# EAGLE design octosonarX2 (EAGLE 8.2.2)
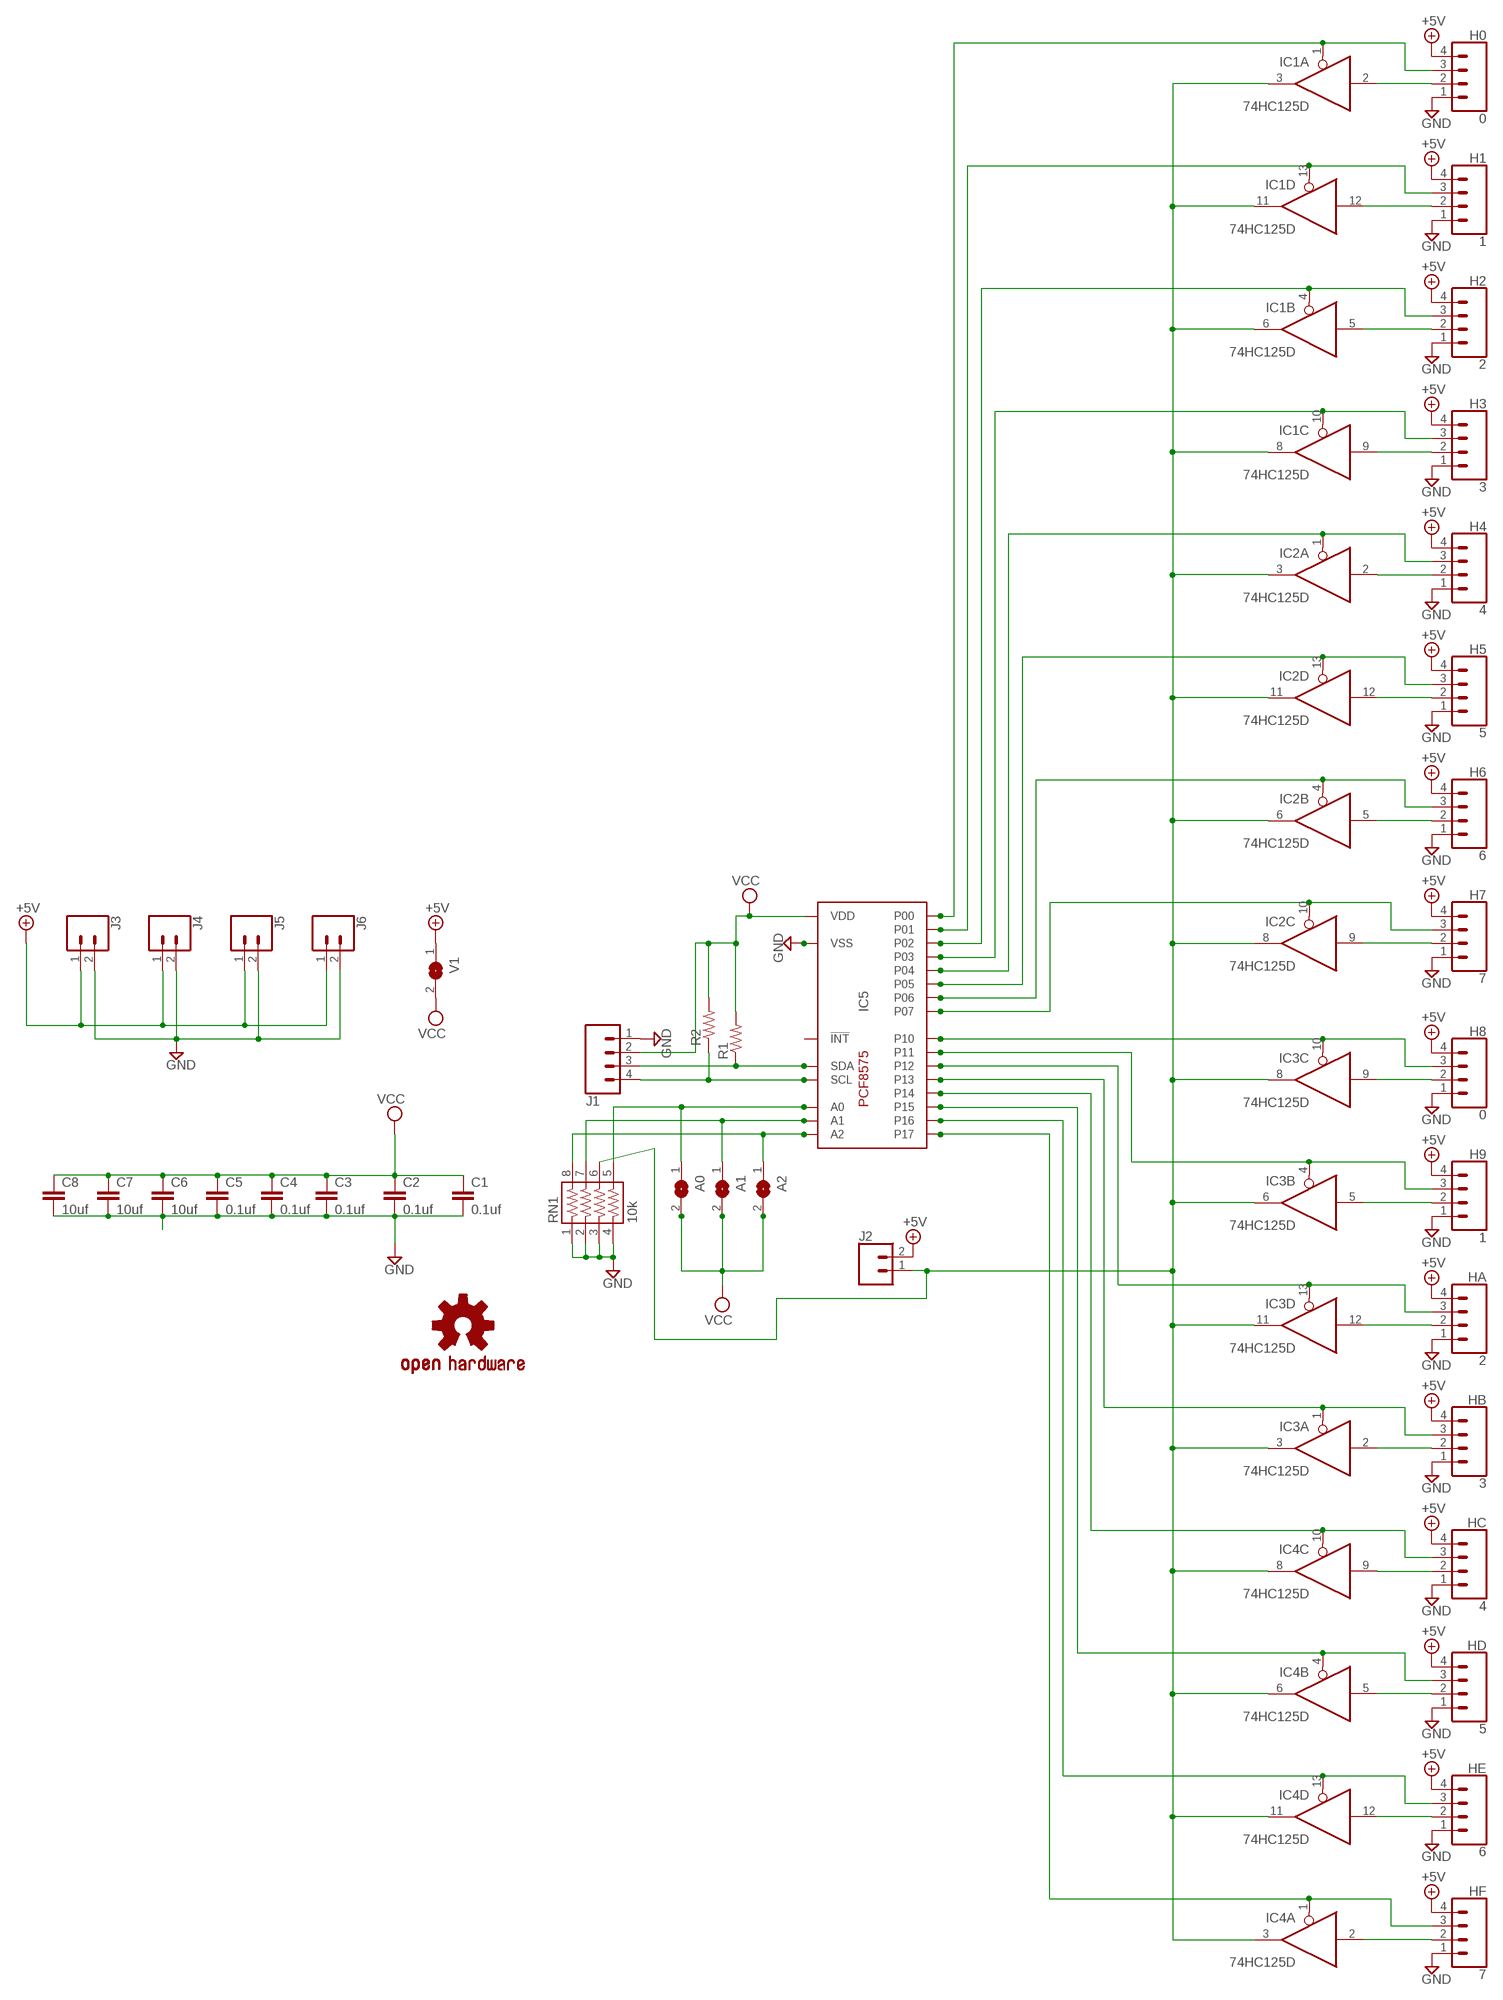
[diagram p0: schematic, sheet 1]

## Parts
A0  SJ  [SJ]
A1  SJ  [SJ]
A2  SJ  [SJ]
C1  0.1uf  C-EUC0603  [C0603]
C2  0.1uf  C-EUC0603  [C0603]
C3  0.1uf  C-EUC0603  [C0603]
C4  0.1uf  C-EUC0603  [C0603]
C5  0.1uf  C-EUC0603  [C0603]
C6  10uf  C-EUC0603  [C0603]
C7  10uf  C-EUC0805  [C0805]
C8  10uf  C-EUC0805  [C0805]
H0  0  CONN_04  [1X04]
H1  1  CONN_04  [1X04]
H2  2  CONN_04  [1X04]
H3  3  CONN_04  [1X04]
H4  4  CONN_04  [1X04]
H5  5  CONN_04  [1X04]
H6  6  CONN_04  [1X04]
H7  7  CONN_04  [1X04]
H8  0  CONN_04  [1X04]
H9  1  CONN_04  [1X04]
HA  2  CONN_04  [1X04]
HB  3  CONN_04  [1X04]
HC  4  CONN_04  [1X04]
HD  5  CONN_04  [1X04]
HE  6  CONN_04  [1X04]
HF  7  CONN_04  [1X04]
IC1  74HC125D  [SO14]
IC2  74HC125D  [SO14]
IC3  74HC125D  [SO14]
IC4  74HC125D  [SO14]
IC5  PCF8575C  [SOP24]
J1  CONN_04POLAR_LOCK  [MOLEX-1X4_LOCK]
J2  CONN_02POLAR_LOCK  [MOLEX-1X2_LOCK]
J3  CONN_02  [1X02]
J4  CONN_02  [1X02]
J5  CONN_02  [1X02]
J6  CONN_02  [1X02]
LOGO1  OSHW-LOGOL  [OSHW-LOGO-L]
R1  R-US_0204/2V  [0204V]
R2  R-US_0204/2V  [0204V]
RN1  10k  743-8  [743-8]
V1  SJ  [SJ]

## Nets
+5V: H0.4 H1.4 H2.4 H3.4 H4.4 H5.4 H6.4 H7.4 H8.4 H9.4 HA.4 HB.4 HC.4 HD.4 HE.4 HF.4 J2.2 J3.1 J4.1 J5.1 J6.1 V1.1
GND: C1.2 C2.2 C3.2 C4.2 C5.2 C6.2 C7.2 C8.2 H0.1 H1.1 H2.1 H3.1 H4.1 H5.1 H6.1 H7.1 H8.1 H9.1 HA.1 HB.1 HC.1 HD.1 HE.1 HF.1 IC5.P$12(VSS) J1.1 J3.2 J4.2 J5.2 J6.2 RN1.1 RN1.2 RN1.3 RN1.4
INT: IC1.3(A:O) IC1.6(B:O) IC1.8(C:O) IC1.11(D:O) IC2.3(A:O) IC2.6(B:O) IC2.8(C:O) IC2.11(D:O) IC3.3(A:O) IC3.6(B:O) IC3.8(C:O) IC3.11(D:O) IC4.3(A:O) IC4.6(B:O) IC4.8(C:O) IC4.11(D:O) J2.1 RN1.6
N$1: H8.3 IC3.10(C:OE) IC5.P$13(P10)
N$2: H9.3 IC3.4(B:OE) IC5.P$14(P11)
N$3: HA.3 IC3.13(D:OE) IC5.P$15(P12)
N$4: HB.3 IC3.1(A:OE) IC5.P$16(P13)
N$5: HC.3 IC4.10(C:OE) IC5.P$17(P14)
N$6: HD.3 IC4.4(B:OE) IC5.P$18(P15)
N$7: HE.3 IC4.13(D:OE) IC5.P$19(P16)
N$8: HF.3 IC4.1(A:OE) IC5.P$20(P17)
N$9: H8.2 IC3.9(C:I)
N$10: H9.2 IC3.5(B:I)
N$11: HA.2 IC3.12(D:I)
N$12: HB.2 IC3.2(A:I)
N$13: HD.2 IC4.5(B:I)
N$14: HE.2 IC4.12(D:I)
N$15: HF.2 IC4.2(A:I)
N$16: HC.2 IC4.9(C:I)
N$18: A2.1 IC5.P$3(A2) RN1.8
N$19: A1.1 IC5.P$2(A1) RN1.7
N$20: A0.1 IC5.P$21(A0) RN1.5
N$25: H0.3 IC1.1(A:OE) IC5.P$4(P00)
N$26: H1.3 IC1.13(D:OE) IC5.P$5(P01)
N$27: H2.3 IC1.4(B:OE) IC5.P$6(P02)
N$28: H3.3 IC1.10(C:OE) IC5.P$7(P03)
N$29: H4.3 IC2.1(A:OE) IC5.P$8(P04)
N$30: H5.3 IC2.13(D:OE) IC5.P$9(P05)
N$31: H6.3 IC2.4(B:OE) IC5.P$10(P06)
N$32: H7.3 IC2.10(C:OE) IC5.P$11(P07)
N$33: H0.2 IC1.2(A:I)
N$34: H1.2 IC1.12(D:I)
N$35: H2.2 IC1.5(B:I)
N$36: H3.2 IC1.9(C:I)
N$37: H5.2 IC2.12(D:I)
N$38: H6.2 IC2.5(B:I)
N$39: H7.2 IC2.9(C:I)
N$40: H4.2 IC2.2(A:I)
SCL: IC5.P$22(SCL) J1.4 R2.1
SDA: IC5.P$23(SDA) J1.3 R1.1
VCC: A0.2 A1.2 A2.2 C1.1 C2.1 C3.1 C4.1 C5.1 C6.1 C7.1 C8.1 IC5.P$24(VDD) J1.2 R1.2 R2.2 V1.2
Unconnected: IC5.P$1(!INT)

## Power pins joined to a net without a drawn wire
GND: IC1.7(P:GND) IC2.7(P:GND) IC3.7(P:GND) IC4.7(P:GND)
VCC: IC1.14(P:VCC) IC2.14(P:VCC) IC3.14(P:VCC) IC4.14(P:VCC)

## Library data of the parts
A0 A1 A2 V1 = jumper:SJ: SMD solder JUMPER
C1-C8 = resistor:C-EU: CAPACITOR, European symbol
H0 H1-H9 HA HB HC HD HE HF = SparkFun-Connectors:CONN_04: Multi connection point. Often used as Generic Header-pin footprint for 0.1 inch spaced/style header connections On any of the 0.1 inch spaced packages, you can populate with these: Break Away Headers - Straight <https://www.sparkfun.com/products/116> (PRT-00116) Break Away Male Headers - Right Angle <https://www.sparkfun.com/products/553> (PRT-00553) Female Headers <https://www.sparkfun.com/products/115> (PRT-00115) Break Away Headers - Machine Pin <https://www.sparkfun.com/products/117> (PRT-00117) Break Away Female Headers - Swiss Machine Pin <https://www.sparkfun.com/products/743> (PRT-00743) For SCREWTERMINALS and SPRING TERMINALS visit here: Screw Terimnals on SparkFun.com <https://www.sparkfun.com/search/results?term=Screw+Terminals> (5mm/3.5mm/2.54mm spacing) This device is also useful as a general connection point to wire up your design to another part of your project. Our various solder wires solder well into these plated through hole pads. Hook-Up Wire - Assortment (Stranded, 22 AWG) <https://www.sparkfun.com/products/11375> (PRT-11375) Hook-Up Wire - Assortment (Solid Core, 22 AWG) <https://www.sparkfun.com/products/11367> (PRT-11367) View the entire wire category on our website here <https://www.sparkfun.com/categories/141> Special notes: Molex polarized connector foot print use with SKU : PRT-08231 with associated crimp pins and housings. 1MM SMD Version SKU: PRT-10208; PROD_ID: CONN-09696
IC1-IC4 = 74xx-eu:74*125: Quad bus BUFFER, 3-state
IC5 = pcf8575c:PCF8575C
J1 = SparkFun-Connectors:CONN_04: Multi connection point. Often used as Generic Header-pin footprint for 0.1 inch spaced/style header connections On any of the 0.1 inch spaced packages, you can populate with these: Break Away Headers - Straight <https://www.sparkfun.com/products/116> (PRT-00116) Break Away Male Headers - Right Angle <https://www.sparkfun.com/products/553> (PRT-00553) Female Headers <https://www.sparkfun.com/products/115> (PRT-00115) Break Away Headers - Machine Pin <https://www.sparkfun.com/products/117> (PRT-00117) Break Away Female Headers - Swiss Machine Pin <https://www.sparkfun.com/products/743> (PRT-00743) For SCREWTERMINALS and SPRING TERMINALS visit here: Screw Terimnals on SparkFun.com <https://www.sparkfun.com/search/results?term=Screw+Terminals> (5mm/3.5mm/2.54mm spacing) This device is also useful as a general connection point to wire up your design to another part of your project. Our various solder wires solder well into these plated through hole pads. Hook-Up Wire - Assortment (Stranded, 22 AWG) <https://www.sparkfun.com/products/11375> (PRT-11375) Hook-Up Wire - Assortment (Solid Core, 22 AWG) <https://www.sparkfun.com/products/11367> (PRT-11367) View the entire wire category on our website here <https://www.sparkfun.com/categories/141> Special notes: Molex polarized connector foot print use with SKU : PRT-08231 with associated crimp pins and housings. 1MM SMD Version SKU: PRT-10208; PROD_ID: CONN-08186; SF_ID: PRT-08231
J2 = SparkFun-Connectors:CONN_02: Multi connection point. Often used as Generic Header-pin footprint for 0.1 inch spaced/style header connections On any of the 0.1 inch spaced packages, you can populate with these: Break Away Headers - Straight <https://www.sparkfun.com/products/116> (PRT-00116) Break Away Male Headers - Right Angle <https://www.sparkfun.com/products/553> (PRT-00553) Female Headers <https://www.sparkfun.com/products/115> (PRT-00115) Break Away Headers - Machine Pin <https://www.sparkfun.com/products/117> (PRT-00117) Break Away Female Headers - Swiss Machine Pin <https://www.sparkfun.com/products/743> (PRT-00743) For SCREWTERMINALS and SPRING TERMINALS visit here: Screw Terimnals on SparkFun.com <https://www.sparkfun.com/search/results?term=Screw+Terminals> (5mm/3.5mm/2.54mm spacing) This device is also useful as a general connection point to wire up your design to another part of your project. Our various solder wires solder well into these plated through hole pads. Hook-Up Wire - Assortment (Stranded, 22 AWG) <https://www.sparkfun.com/products/11375> (PRT-11375) Hook-Up Wire - Assortment (Solid Core, 22 AWG) <https://www.sparkfun.com/products/11367> (PRT-11367) View the entire wire category on our website here <https://www.sparkfun.com/categories/141> Special notes: Molex polarized connector foot print use with: PRT-08233 with associated crimp pins and housings. 2.54_SCREWTERM for use with PRT-10571. 3.5mm Screw Terminal footprints for PRT-08084 5mm Screw Terminal footprints for use with PRT-08432; SF_ID: PRT-09918
J3-J6 = SparkFun-Connectors:CONN_02: Multi connection point. Often used as Generic Header-pin footprint for 0.1 inch spaced/style header connections On any of the 0.1 inch spaced packages, you can populate with these: Break Away Headers - Straight <https://www.sparkfun.com/products/116> (PRT-00116) Break Away Male Headers - Right Angle <https://www.sparkfun.com/products/553> (PRT-00553) Female Headers <https://www.sparkfun.com/products/115> (PRT-00115) Break Away Headers - Machine Pin <https://www.sparkfun.com/products/117> (PRT-00117) Break Away Female Headers - Swiss Machine Pin <https://www.sparkfun.com/products/743> (PRT-00743) For SCREWTERMINALS and SPRING TERMINALS visit here: Screw Terimnals on SparkFun.com <https://www.sparkfun.com/search/results?term=Screw+Terminals> (5mm/3.5mm/2.54mm spacing) This device is also useful as a general connection point to wire up your design to another part of your project. Our various solder wires solder well into these plated through hole pads. Hook-Up Wire - Assortment (Stranded, 22 AWG) <https://www.sparkfun.com/products/11375> (PRT-11375) Hook-Up Wire - Assortment (Solid Core, 22 AWG) <https://www.sparkfun.com/products/11367> (PRT-11367) View the entire wire category on our website here <https://www.sparkfun.com/categories/141> Special notes: Molex polarized connector foot print use with: PRT-08233 with associated crimp pins and housings. 2.54_SCREWTERM for use with PRT-10571. 3.5mm Screw Terminal footprints for PRT-08084 5mm Screw Terminal footprints for use with PRT-08432
LOGO1 = SparkFun-Aesthetics:OSHW-LOGO: Open-Source Hardware (OSHW) Logo This logo indicates the piece of hardware it is found on incorporates a OSHW license and/or adheres to the definition of open source hardware found here: http://freedomdefined.org/OSHW
R1 R2 = rcl:R-US_: RESISTOR, American symbol
RN1 = resistor-array:743-8: CTS 743 Series 8 Terminations, 4 Resistors

## Board
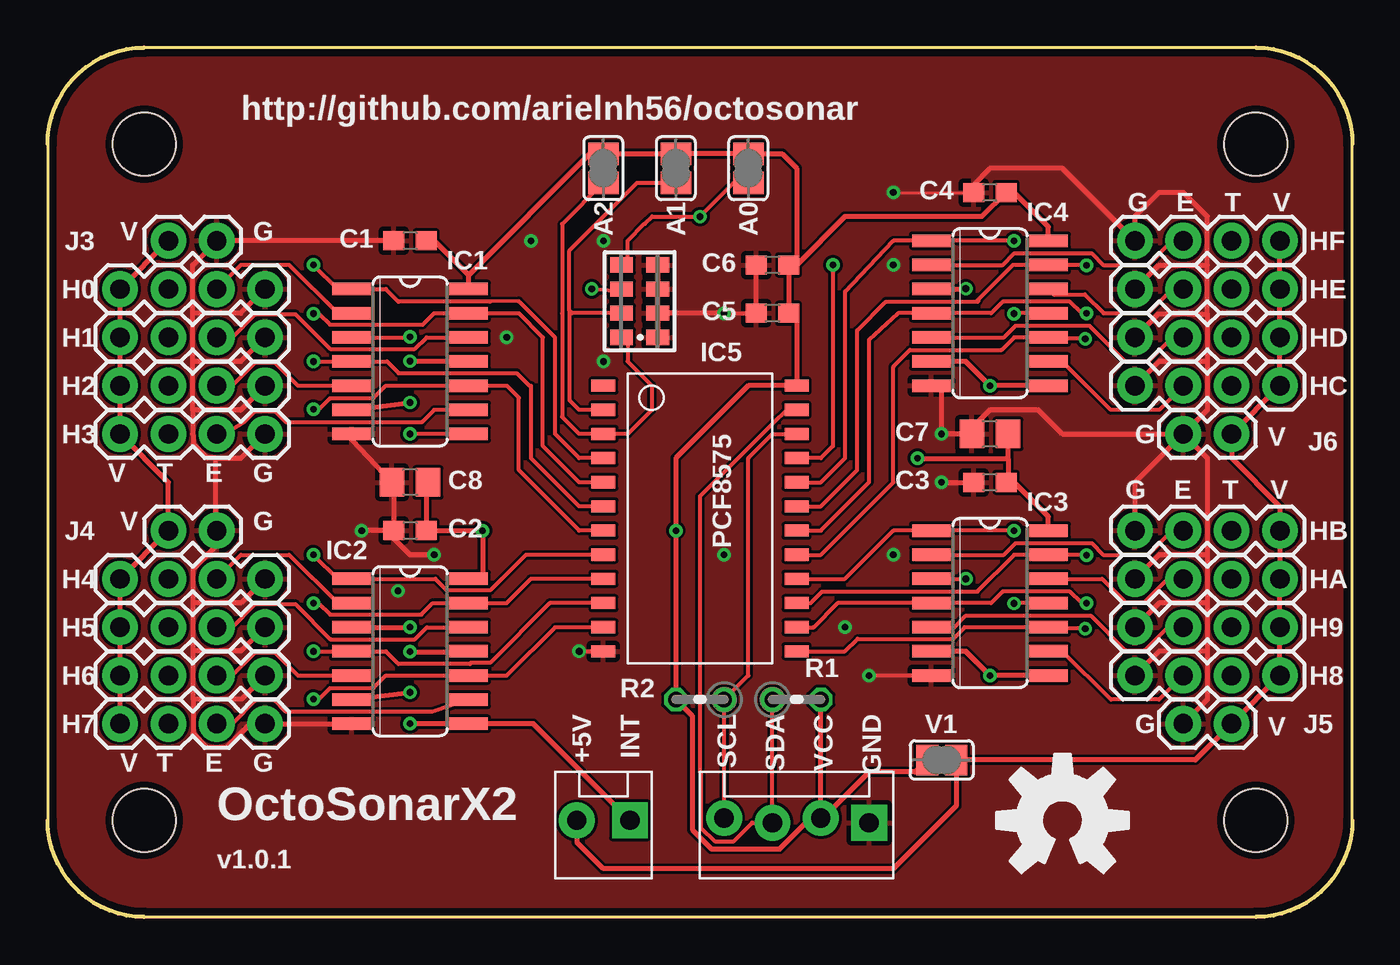
[diagram p1: board, top side]
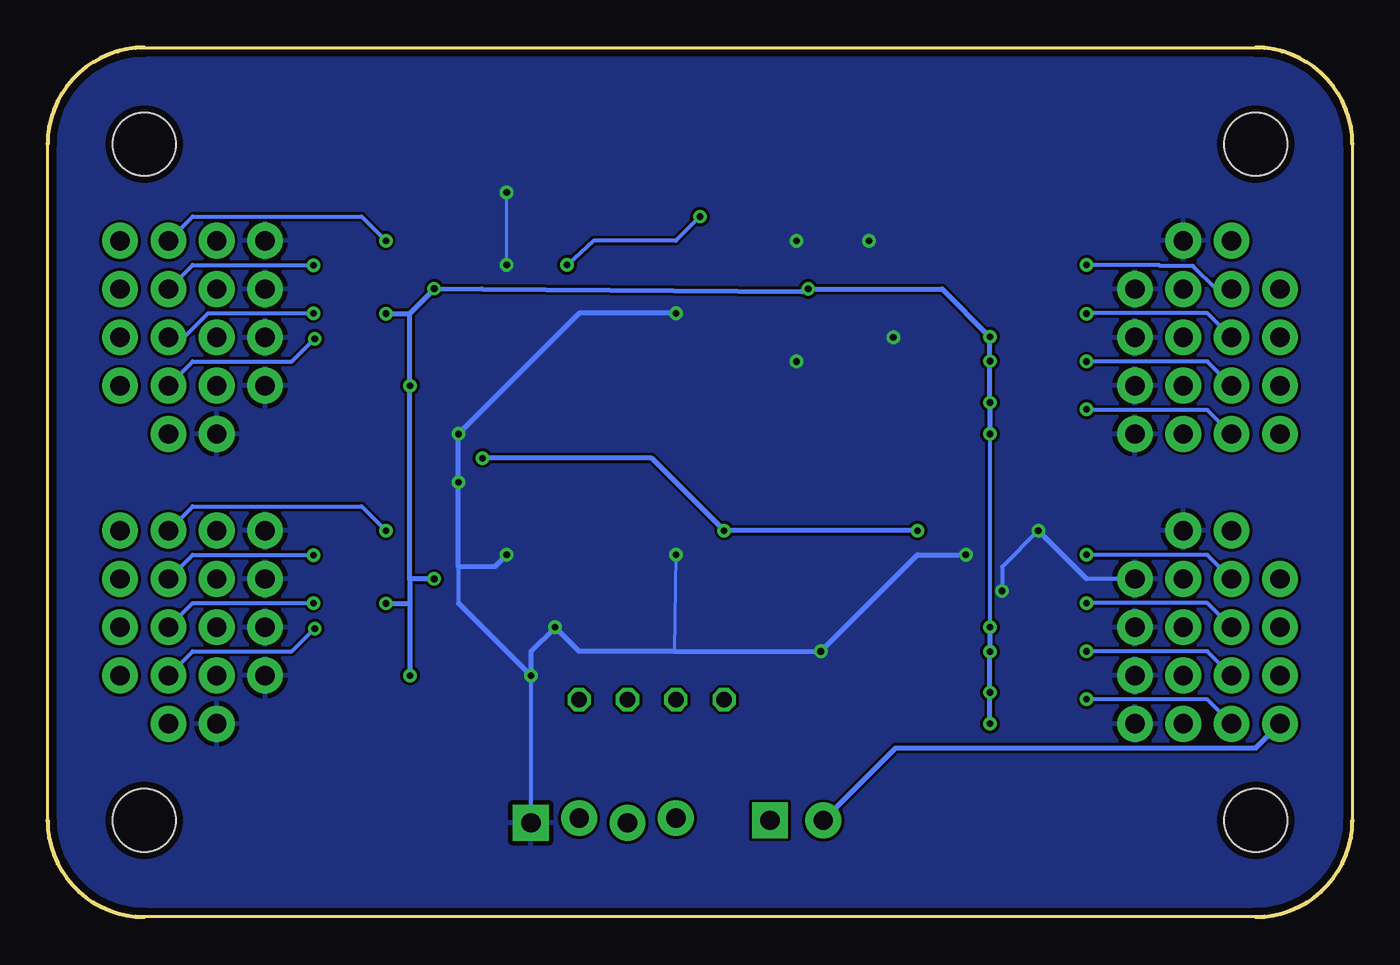
[diagram p2: board, bottom side, seen from below]

Size 68.58 x 45.72 mm. Coordinates in mm from the lower left corner, seen from the top.
Outline: 5.08,0 63.5,0 arc90 68.58,5.08 68.58,40.64 arc90 63.5,45.72 5.08,45.72 arc90 0,40.64 0,5.08 arc90 5.08,0
Copper layers (1*16): Top 0.0356mm / dielectric 1.5011mm / Bottom 0.0356mm
Design rules "mypcbway": minimum track width 6mil, minimum drill 13mil, track to track 6mil, track to pad 6mil, pad to pad 6mil, via to via 6mil, smd to smd 6mil, copper to edge 15mil, drill to drill 6mil, minimum pad ring 7mil, minimum via ring 7mil, stop-mask expansion 2.5mil, vias tented up to drill 24mil, thermal gap 10mil

### Footprints (pad centres in the part's own frame; a part is rotated, then mirrored left to right if it is on the bottom)
SJ = smd 1.168 x 1.6: 1 -0.762,0; 2 0.762,0
C0603 = smd 1.1 x 1: 1 -0.85,0; 2 0.85,0
C0805 = smd 1.3 x 1.5: 1 -0.95,0; 2 0.95,0
1X04 = drill 1.016 pad 1.88: 1 0,0; 2 2.54,0; 3 5.08,0; 4 7.62,0
SO14 = smd 0.66 x 2.032: 1 -3.81,-3.073; 2 -2.54,-3.073; 3 -1.27,-3.073; 4 0,-3.073; 5 1.27,-3.073; 6 2.54,-3.073; 7 3.81,-3.073; 8 3.81,3.073; 9 2.54,3.073; 10 1.27,3.073; 11 0,3.073; 12 -1.27,3.073; 13 -2.54,3.073; 14 -3.81,3.073
SOP24 = smd 1.27 x 0.635: P$1 -5.08,6.985; P$2 -5.08,5.715; P$3 -5.08,4.445; P$4 -5.08,3.175; P$5 -5.08,1.905; P$6 -5.08,0.635; P$7 -5.08,-0.635; P$8 -5.08,-1.905; P$9 -5.08,-3.175; P$10 -5.08,-4.445; P$11 -5.08,-5.715; P$12 -5.08,-6.985; P$13 5.08,-6.985; P$14 5.08,-5.715; P$15 5.08,-4.445; P$16 5.08,-3.175; P$17 5.08,-1.905; P$18 5.08,-0.635; P$19 5.08,0.635; P$20 5.08,1.905; P$21 5.08,3.175; P$22 5.08,4.445; P$23 5.08,5.715; P$24 5.08,6.985
MOLEX-1X4_LOCK = drill 1.016 pad 1.88 square: 1 0,0.127 | drill 1.016 pad 1.88: 2 2.54,-0.127; 3 5.08,0.127; 4 7.62,-0.127
MOLEX-1X2_LOCK = drill 1.016 pad 1.88 square: 1 -0.127,0 | drill 1.016 pad 1.88: 2 2.667,0
1X02 = drill 1.016 pad 1.88: 1 0,0; 2 2.54,0
0204V = drill 0.813 octagon: 1 -1.27,0; 2 1.27,0
743-8 = smd 0.8 x 1.2: 1 -1.905,-0.953; 2 -0.635,-0.953; 3 0.635,-0.953; 4 1.905,-0.953; 5 1.905,0.953; 6 0.635,0.953; 7 -0.635,0.953; 8 -1.905,0.953
STAND-OFF = hole 3.302: 0,0

### Placement (x,y rotation side)
A0  36.83,39.37 90 top
A1  33.02,39.37 90 top
A2  29.21,39.37 90 top
C1  19.05,35.56 180 top
C2  19.05,20.32 180 top
C3  49.53,22.86 180 top
C4  49.53,38.1 180 top
C5  38.1,31.75 180 top
C6  38.1,34.29 180 top
C7  49.53,25.4 180 top
C8  19.05,22.86 180 top
H0  11.43,33.02 180 top
H1  11.43,30.48 180 top
H2  11.43,27.94 180 top
H3  11.43,25.4 180 top
H4  11.43,17.78 180 top
H5  11.43,15.24 180 top
H6  11.43,12.7 180 top
H7  11.43,10.16 180 top
H8  57.15,12.7 0 top
H9  57.15,15.24 0 top
HA  57.15,17.78 0 top
HB  57.15,20.32 0 top
HC  57.15,27.94 0 top
HD  57.15,30.48 0 top
HE  57.15,33.02 0 top
HF  57.15,35.56 0 top
IC1  19.05,29.21 270 top
IC2  19.05,13.97 270 top
IC3  49.53,16.51 270 top
IC4  49.53,31.75 270 top
IC5  34.29,20.95 0 top
J1  43.18,5.08 180 top
J2  30.48,5.08 180 top
J3  6.35,35.56 0 top
J4  6.35,20.32 0 top
J5  62.23,10.16 180 top
J6  62.23,25.4 180 top
LOGO1  53.34,5.08 0 top
R1  39.37,11.43 0 top
R2  34.29,11.43 180 top
RN1  31.11,32.38 90 top
U$2  [STAND-OFF]  5.08,5.08 0 top
U$3  [STAND-OFF]  63.5,5.08 0 top
U$4  [STAND-OFF]  63.5,40.64 0 top
U$5  [STAND-OFF]  5.08,40.64 0 top
V1  46.99,8.26 180 top

### Tracks (layer width: path | path; a pad name or v marks a point on that pad's centre or on a via)
+5V
  Top 0.254: H7.4 H6.4 H5.4 H4.4 J4.1 6.35,22.86 H3.4 H2.4 H1.4 H0.4 J3.1 | HF.4 HE.4 HD.4 HC.4 J6.1 62.23,24.13 64.77,21.59 HB.4 64.77,20.14 HA.4 H9.4 H8.4 J5.1 60.33,8.26 V1.1 47.75,5.84 44.45,2.54 29.21,2.54 27.81,3.94 J2.2
  Bottom 0.254: J2.2 24,8.89 5.08,8.89 H7.4
GND  (via drill 0.35)
  Top 0.152: v44.45,38.1 C4.2
  Top 0.2: v43.18,12.7 IC3.7 | 15.98,25.08 IC1.7 | v35.56,31.75 C5.2 | 46.99,27.94 IC4.7 | C4.2 48.68,38.52 | C8.2 18.2,22.76 | IC5.P$12 v27.94,13.97 | 18.2,19.9 C2.2
  Top 0.254: RN1.4 RN1.3 RN1.2 | RN1.2 RN1.1 | J6.2 53.34,25.4 52.07,26.67 49.53,26.67 48.58,25.72 C7.2 v46.99,25.4 46.99,27.94 | J6.2 57.15,22.86 HB.1 | v46.99,22.86 C3.2 | IC2.7 H7.1 10.65,10.16 9.41,8.91 8.37,8.91 7.64,9.64 7.64,11.46 | v16.51,20.32 C2.2 18.2,22.76 | 15.98,25.08 C8.2 | v35.56,31.75 RN1.2 | C5.2 C6.2 | 48.68,38.52 49.53,39.37 53.34,39.37 HF.1 57.15,36.83 58.42,38.1 59.69,38.1 60.96,36.83 60.96,34.28 | v20.32,19.05 19.05,19.05 18.2,19.9 | 7.64,16.52 7.64,18.3 8.89,19.54 J4.2 8.83,20.38 8.83,24.13 | 7.64,13.99 7.64,16.52 | 7.64,11.46 7.64,13.99 | H4.1 10.17,16.52 7.64,16.52 | H5.1 10.18,13.99 7.64,13.99 | 7.64,11.46 8.37,11.46 10.19,11.46 H6.1 | C1.2 J3.2 7.62,34.29 7.62,31.75 | 7.62,29.21 7.62,31.75 | 7.62,26.65 7.62,29.21 | 7.62,26.65 7.62,25.4 7.64,25.38 7.64,24.88 8.4,24.13 8.83,24.13 | 8.83,24.13 10.16,24.13 H3.1 | H0.1 10.15,31.75 7.62,31.75 | H1.1 10.16,29.21 7.62,29.21 | H2.1 10.14,26.65 7.62,26.65 | J6.2 60.96,26.67 60.96,29.21 | 60.96,31.71 60.96,34.28 | 60.96,31.71 60.96,29.21 | HE.1 58.41,34.28 60.96,34.28 | 60.96,31.71 60.22,31.71 60.21,31.73 58.4,31.73 HD.1 | 60.96,29.21 58.42,29.21 HC.1 | J6.2 60.96,24.13 60.96,19.05 | 60.96,19.05 60.96,16.51 | 60.96,16.51 60.96,13.97 | 60.96,13.97 60.96,11.43 J5.2 | 60.96,13.97 58.42,13.97 H8.1 | 60.96,16.51 58.42,16.51 H9.1 | 60.96,19.05 58.42,19.05 HA.1
  Bottom 0.152: v35.56,19.05 35.63,13.97 | v44.45,34.29 v44.45,38.1
  Bottom 0.2: v43.18,12.7 J1.1 | 46.99,18.42 46.99,16.51 | H4.1 13.97,17.78 | v16.51,20.32 18.41,18.41 v18.41,17.14
  Bottom 0.254: 46.99,16.51 v43.18,12.7 43.18,13.97 v41.91,15.24 40.64,13.97 35.63,13.97 v27.94,13.97 22.86,19.05 v20.32,19.05 | 13.97,17.78 v16.51,20.32 | v35.56,31.75 40.64,31.75 v46.99,25.4 v46.99,22.86 46.99,18.42 45.08,18.42 v44.45,19.05
  other vias: 25.4,35.56 29.21,35.56 24.13,30.48 29.21,29.21
  pour Top: 0,45.72 68.58,45.72 68.58,0 0,0
  pour Bottom: 0,45.72 68.58,45.72 68.58,0 0,0
INT  (via drill 0.35)
  Top 0.2: v49.54,27.94 v49.53,27.94 | 48.24,33.02 v48.26,33.04 | IC4.11 50.82,31.75 v50.8,31.73 | v49.54,12.7 v49.53,12.7 | IC3.3 v48.26,17.78 | IC3.11 50.82,16.51 v50.8,16.49 | 22.1,13.95 IC2.11 | IC1.3 19.03,30.48 v19.05,30.5 | 22.1,29.23 IC1.11 | IC1.8 v19.05,25.4 | RN1.6 30.04,32.9 v28.6,33.03
  Top 0.254: IC4.8 v49.54,27.94 | v49.53,27.94 48.26,29.21 IC4.6 | IC4.3 48.24,33.02 | IC3.8 v49.54,12.7 | v49.53,12.7 48.26,13.97 IC3.6 | IC2.3 v19.05,15.24 | v19.05,13.95 22.1,13.95 | IC2.6 v19.05,11.81 | v19.05,10.16 IC2.8 25.53,10.16 J2.1 | v19.05,29.23 22.1,29.23 | IC1.6 v19.05,27.05
  Bottom 0.2: 48.26,33.02 v48.26,33.04 | 49.55,27.95 v49.54,27.94 | 49.55,12.71 v49.54,12.7 | 49.52,17.78 49.55,17.74 | v19.05,25.4 v19.05,15.24
  Bottom 0.254: v50.8,31.73 49.55,31.73 | 49.55,31.73 48.26,33.02 | 49.55,31.73 49.55,27.95 49.55,17.74 49.55,16.49 | v50.8,16.49 49.55,16.49 | 49.55,16.49 49.55,12.71 | v19.05,15.24 v19.05,13.95 v19.05,11.81 v19.05,10.16 | v48.26,17.78 49.52,17.78 | v19.05,25.4 v19.05,27.05 v19.05,29.23 v19.05,30.5 21.57,33.02 v28.6,33.03 28.95,32.89 45.74,33.02 v48.26,33.04
N$1  (via drill 0.35)
  Top 0.2: IC5.P$13 41.91,13.97 42.57,14.63 47.59,14.63 48.2,15.24 IC3.10 52.67,15.17 v54.54,15.17
  Bottom 0.2: H8.3 60.96,13.97 55.74,13.97 v54.54,15.17
N$2  (via drill 0.35)
  Top 0.2: IC5.P$14 40.26,15.24 41.53,16.51 IC3.4 49.59,16.51 50.2,17.12 53.73,17.12 54.34,16.51 v54.61,16.51
  Bottom 0.2: H9.3 60.96,16.51 v54.61,16.51
N$3  (via drill 0.35)
  Top 0.2: IC5.P$15 40.11,16.51 40.71,17.12 48.87,17.12 50.8,19.05 IC3.13 52.63,19.03 v54.61,19.03
  Bottom 0.2: HA.3 60.96,19.05 54.63,19.05 v54.61,19.03
N$4  (via drill 0.35)
  Top 0.2: IC5.P$16 41.91,17.78 44.45,20.32 IC3.1 v50.8,20.32
  Bottom 0.2: HB.3 60.96,21.59 52.07,21.59 v50.8,20.32
N$5  (via drill 0.35)
  Top 0.2: IC5.P$17 40.64,19.05 44.45,22.86 44.45,28.94 45.33,29.82 50.14,29.82 50.8,30.48 IC4.10 52.67,30.41 v54.54,30.41
  Bottom 0.2: HC.3 60.96,29.21 55.74,29.21 v54.54,30.41
N$6  (via drill 0.35)
  Top 0.2: IC5.P$18 40.64,20.32 43.18,22.86 43.18,30.36 44.7,31.75 IC4.4 49.59,31.75 50.2,32.36 53.73,32.36 54.34,31.75 v54.61,31.75
  Bottom 0.2: HD.3 61.41,30.48 60.14,31.75 v54.61,31.75 54.66,31.7
N$7  (via drill 0.35)
  Top 0.2: IC5.P$19 40.64,21.59 42.55,23.5 42.55,30.85 44.06,32.36 48.87,32.36 48.92,32.41 48.86,32.41 50.74,34.29 IC4.13 52.63,34.27 v54.61,34.27
  Bottom 0.2: HE.3 60.96,34.29 54.63,34.29 v54.61,34.27
N$8  (via drill 0.35)
  Top 0.2: IC5.P$20 40.64,22.86 41.91,24.13 41.91,32.9 44.45,35.56 IC4.1 v50.8,35.56
  Bottom 0.2: HF.3 60.96,36.83 52.07,36.83 v50.8,35.56
N$9
  Top 0.2: H8.2 58.42,11.43 55.88,11.43 53.34,13.97 IC3.9
N$10
  Top 0.2: IC3.5 47.66,15.24 48.27,15.85 54.82,15.85 56.65,14.02 57.65,14.02 58.87,15.24 H9.2
N$11
  Top 0.2: IC3.12 55.43,17.78 56.65,16.56 57.65,16.56 58.87,17.78 HA.2
N$12
  Top 0.2: IC3.2 50.27,19.05 50.87,19.66 54.87,19.66 55.48,19.05 57.85,19.05 59.12,20.32 HB.2
N$13
  Top 0.2: IC4.5 50.27,30.48 50.87,31.09 54.75,31.09 56.63,29.21 57.85,29.21 59.12,30.48 HD.2
N$14
  Top 0.2: IC4.12 52.89,32.74 54.52,32.74 55.5,31.75 57.85,31.75 59.12,33.02 HE.2
N$15
  Top 0.2: IC4.2 50.2,34.29 50.81,34.9 54.87,34.9 55.48,34.29 57.85,34.29 59.12,35.56 HF.2
N$16
  Top 0.2: HC.2 58.42,26.67 55.88,26.67 53.34,29.21 IC4.9
N$18
  Top 0.2: IC5.P$3 27.94,25.4 27.05,26.29 27.05,31.74 | 29.2,25.44 29.12,25.44 IC5.P$3 | 27.05,31.74 | A2.1 27.05,36.45 27.05,31.74 | RN1.8 30.48,30.16 30.48,29.21 31.75,27.94 31.75,26.67 30.48,25.4 IC5.P$3
N$19
  Top 0.2: IC5.P$2 27.94,26.67 27.43,27.18 27.43,31.9 | RN1.7 27.57,31.75 27.43,31.9 | 27.43,31.9 27.43,35.05 30.99,38.61 A1.1
N$20  (via drill 0.35)
  Top 0.2: RN1.5 30.48,34.61 30.48,35.56 31.37,36.45 31.4,36.45 31.78,36.83 v34.29,36.83 36.07,38.61 A0.1 | IC5.P$21 40.64,24.13 41.27,24.77 v41.27,34.29
  Bottom 0.2: v34.29,36.83 35.56,35.56 39.88,35.56 v41.27,34.29
N$25  (via drill 0.35)
  Top 0.2: IC5.P$4 27.94,24.13 26.67,25.4 26.67,30.48 24.77,32.38 24.75,32.38 23.25,32.36 18.44,32.36 17.78,33.02 IC1.1 15.24,33.02 v13.97,34.29
  Bottom 0.2: H0.3 7.17,33.02 8.39,34.24 10.11,34.24 10.16,34.29 v13.97,34.29
N$26  (via drill 0.35)
  Top 0.2: IC5.P$5 27.94,22.86 26.04,24.77 26.04,30.48 24.77,31.75 IC1.13 22.1,31.73 22.08,31.75 20.32,31.75 19.71,31.14 14.85,31.14 14.26,31.73 v13.97,31.73
  Bottom 0.2: H1.3 7.62,31.75 13.95,31.75 v13.97,31.73
N$27  (via drill 0.35)
  Top 0.2: IC5.P$6 27.94,21.59 25.4,24.13 25.4,27.86 | 25.4,27.86 25.4,27.94 | 25.4,27.86 24.66,28.6 18.45,28.6 17.84,29.21 IC1.4 v13.97,29.21
  Bottom 0.2: H2.3 7.62,29.21 v13.97,29.21
N$28  (via drill 0.35)
  Top 0.2: IC5.P$7 27.94,20.32 24.77,23.5 24.77,27.3 24.13,27.94 IC1.10 17.78,27.94 17.12,27.28 14.85,27.28 14.26,26.69 v13.97,26.69
  Bottom 0.2: H3.3 7.62,26.67 13.95,26.67 v13.97,26.69
N$29  (via drill 0.35)
  Top 0.2: IC5.P$8 25.13,19.05 23.25,17.17 20.99,17.17 20.38,17.78 IC2.1 15.24,17.78 v13.97,19.05
  Bottom 0.2: H4.3 7.62,19.05 v13.97,19.05
N$30  (via drill 0.35)
  Top 0.2: IC5.P$9 25.4,17.78 24.13,16.51 IC2.13 20.26,16.51 19.65,15.9 14.85,15.9 14.24,16.51 v13.97,16.51
  Bottom 0.2: H5.3 7.62,16.51 v13.97,16.51
N$31  (via drill 0.35)
  Top 0.2: IC5.P$10 26.4,16.51 23.25,13.36 22.25,13.36 22.2,13.31 18.44,13.31 17.78,13.97 IC2.4 v13.97,13.97
  Bottom 0.2: H6.3 7.62,13.97 v13.97,13.97
N$32  (via drill 0.35)
  Top 0.2: IC5.P$11 26.67,15.24 24.13,12.7 IC2.10 17.78,12.7 17.12,12.04 14.85,12.04 14.26,11.45 v13.97,11.45
  Bottom 0.2: H7.3 7.62,11.43 13.95,11.43 v13.97,11.45
N$33
  Top 0.2: IC1.2 15.24,31.75 12.7,34.29 10.16,34.29 H0.2
N$34
  Top 0.2: H1.2 9.71,30.48 10.93,31.7 13.02,31.7 14.85,29.87 19.31,29.87 19.92,30.48 IC1.12
N$35
  Top 0.2: H2.2 9.71,27.94 10.93,29.16 11.93,29.16 13.15,27.94 IC1.5
N$36
  Top 0.2: IC1.9 20.32,26.67 19.68,26.03 12.52,26.03 11.93,26.62 10.93,26.62 10.34,26.03 9.52,25.52 H3.2
N$37
  Top 0.2: H5.2 9.71,15.24 10.93,16.46 13.02,16.46 14.87,14.61 19.31,14.61 19.94,15.24 IC2.12
N$38
  Top 0.2: H6.2 9.71,12.7 10.93,13.92 11.93,13.92 13.15,12.7 IC2.5
N$39
  Top 0.2: H7.2 9.71,10.16 10.93,11.38 11.93,11.38 12.52,10.79 20.21,10.79 IC2.9
N$40
  Top 0.2: H4.2 10.16,19.05 12.7,19.05 15.24,16.51 IC2.2
SCL
  Top 0.2: J1.4 R2.1 36.83,12.7 36.83,24.13 38.1,25.4 IC5.P$22
SDA
  Top 0.2: R1.1 J1.3 37.03,4.95 36.06,3.99 35.06,3.99 34.34,4.7 34.34,7.57 34.29,7.62 34.29,22.12 38.16,26 38.82,26.63 IC5.P$23
VCC  (via drill 0.35)
  Top 0.2: 20.32,35.56 C1.1 | 50.8,22.86 C3.1 | C4.1 50.8,38.1 | 39.37,31.33 C5.1 | 37.34,40.13 A0.2 | 39.37,34.29 C6.1 38.95,34.17 39.37,34.59 | 28.5,40.13 A2.2
  Top 0.254: IC1.14 22.12,33.76 | 22.12,33.76 20.32,35.56 | IC3.14 52.6,21.06 50.8,22.86 | IC4.14 52.6,36.3 50.8,38.1 | 39.37,31.33 IC5.P$24 36.83,27.94 33.02,24.13 v33.02,20.32 R2.2 33.88,10.56 33.88,4.59 34.89,3.58 38.49,3.58 40.11,5.21 J1.2 | 38.95,34.17 C5.1 | J1.2 R1.2 | C4.1 49.11,36.83 41.91,36.83 39.37,34.29 | A2.2 A1.2 A0.2 38.61,40.13 39.37,39.37 39.37,34.59 | 22.12,33.76 28.5,40.13 | V1.2 45.59,7.62 43.18,7.62 40.77,5.21 J1.2 | C8.1 19.9,22.76 C2.1 v22.86,20.32 22.86,17.78 IC2.14 | C3.1 50.48,22.96 50.48,24.12 | 50.48,24.12 C7.1 | v45.72,24.13 45.73,24.12 50.48,24.12
  Bottom 0.254: v22.86,20.32 v33.02,20.32 36.83,24.13 v45.72,24.13

### Text on the board
tPlace: http://github.com/arielnh56/octosonar | G | E | T | V | V | G | G | V | V | T | E | G | G | E | T | V | V | G | G | V | V | T | E | G | OctoSonarX2 | v1.0.1
tNames: +5V | INT | SCL | SDA | VCC | GND